# EAGLE design MicroSD Module (EAGLE 6.1)
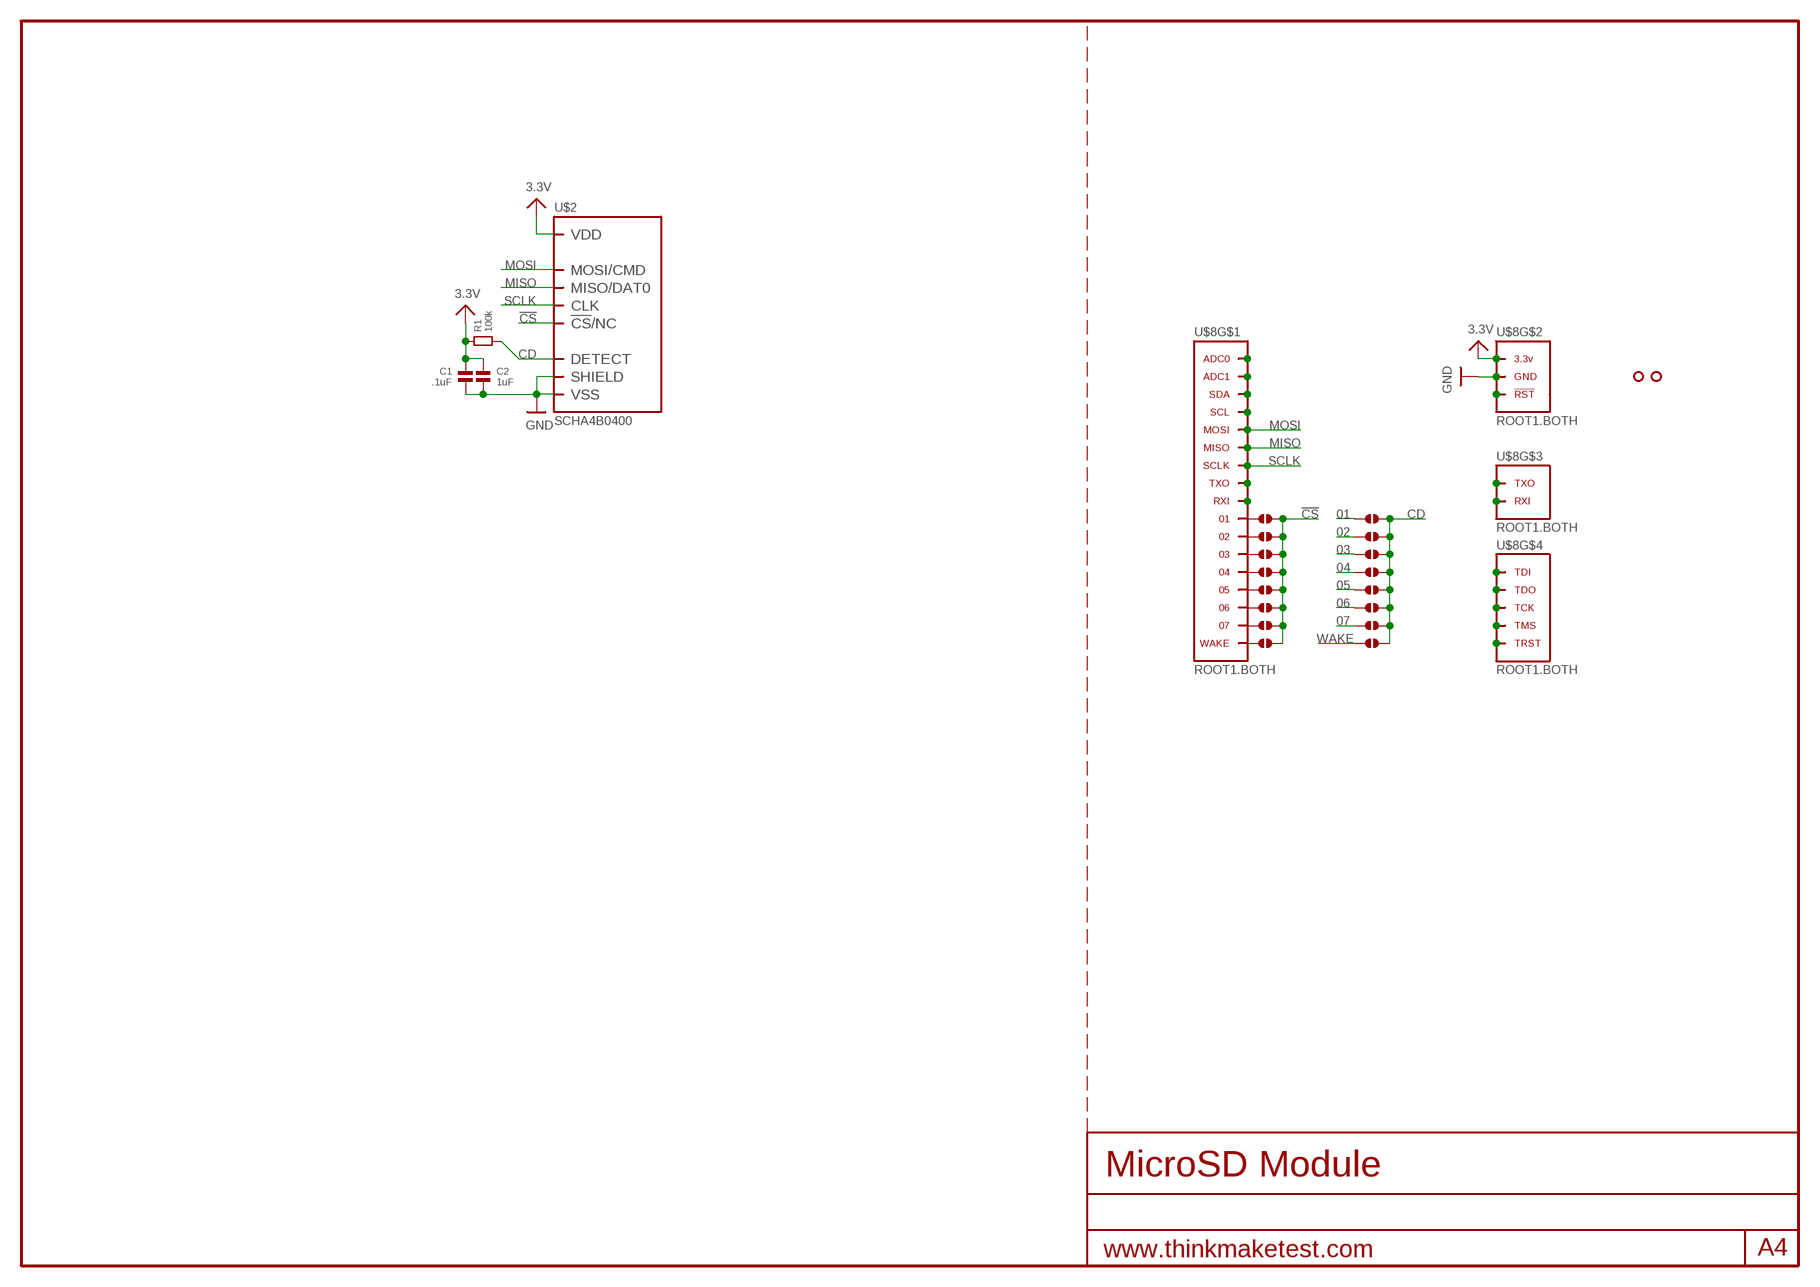
[diagram p0: schematic, sheet 1]

## Parts
C1  .1uF  CAPACITOR.0603  [0603]
C2  1uF  CAPACITOR.0603  [0603]
J1  SOLDERJUMPER.2.SML  [2.SML]
J2  SOLDERJUMPER.2.SML  [2.SML]
J3  SOLDERJUMPER.2.SML  [2.SML]
J4  SOLDERJUMPER.2.SML  [2.SML]
J5  SOLDERJUMPER.2.SML  [2.SML]
J6  SOLDERJUMPER.2.SML  [2.SML]
J7  SOLDERJUMPER.2.SML  [2.SML]
J8  SOLDERJUMPER.2.SML  [2.SML]
J9  SOLDERJUMPER.2.SML  [2.SML]
J10  SOLDERJUMPER.2.SML  [2.SML]
J11  SOLDERJUMPER.2.SML  [2.SML]
J12  SOLDERJUMPER.2.SML  [2.SML]
J13  SOLDERJUMPER.2.SML  [2.SML]
J14  SOLDERJUMPER.2.SML  [2.SML]
J15  SOLDERJUMPER.2.SML  [2.SML]
J16  SOLDERJUMPER.2.SML  [2.SML]
R1  100k  RESISTOR.0603  [0603]
U$2  SCHA4B0400  [SCHA4B0400]
U$3  HOLE.2MM  [2MM]
U$4  HOLE.2MM  [2MM]
U$8  ROOT1.BOTH  [ROOT1.BOTH]

## Nets
01: J1.1 J9.1 U$8.01 U$8.01@1 U$8.01@VIA
02: J2.1 J10.1 U$8.02 U$8.02@1 U$8.02@VIA
03: J3.1 J11.1 U$8.03 U$8.03@1 U$8.03@VIA
3.3V: C1.1 C2.1 R1.1 U$2.VDD U$8.3.3V@1(3.3V) U$8.3.3V@2(3.3V) U$8.3.3V@3(3.3V) U$8.3.3V@4(3.3V) U$8.3.3V@5(3.3V) U$8.3.3V@6(3.3V) U$8.3.3V@7(3.3V) U$8.3.3V@8(3.3V) U$8.3.3V@9(3.3V) U$8.3.3V@10(3.3V) U$8.3.3V@11(3.3V) U$8.3.3V@12(3.3V) U$8.3.3V@13(3.3V) U$8.3.3V@14(3.3V) U$8.3.3V@15(3.3V) U$8.3.3V@16(3.3V) U$8.3.3V@17(3.3V) U$8.3.3V@18(3.3V) U$8.3.3V@19(3.3V) U$8.3.3V@20(3.3V) U$8.3.3V@21(3.3V) U$8.3.3V@22(3.3V) U$8.3.3V@23(3.3V) U$8.3.3V@24(3.3V) U$8.3.3V@VIA(3.3V)
04: J4.1 J12.1 U$8.04 U$8.04@1 U$8.04@VIA
05: J5.1 J13.1 U$8.05 U$8.05@1 U$8.05@VIA
06: J6.1 J14.1 U$8.06 U$8.06@1 U$8.06@VIA
07: J7.1 J15.1 U$8.07 U$8.07@1 U$8.07@VIA
!CS!: J1.2 J2.2 J3.2 J4.2 J5.2 J6.2 J7.2 J8.2 U$2.!CS!/NC/DAT3(!CS!/NC)
CD: J9.2 J10.2 J11.2 J12.2 J13.2 J14.2 J15.2 J16.2 R1.2 U$2.CD(DETECT)
GND: C1.2 C2.2 U$2.GND(VSS) U$2.GND@1(VSS) U$2.GND@2(VSS) U$2.SHIELD U$2.SHIELD@1(SHIELD) U$2.SHIELD@2(SHIELD) U$2.SHIELD@3(SHIELD) U$2.VSS U$8.GND@1(GND) U$8.GND@2(GND) U$8.GND@3(GND) U$8.GND@4(GND) U$8.GND@5(GND) U$8.GND@6(GND) U$8.GND@7(GND) U$8.GND@8(GND) U$8.GND@9(GND) U$8.GND@10(GND) U$8.GND@11(GND) U$8.GND@12(GND) U$8.GND@13(GND) U$8.GND@14(GND) U$8.GND@15(GND) U$8.GND@16(GND) U$8.GND@17(GND) U$8.GND@18(GND) U$8.GND@19(GND) U$8.GND@20(GND) U$8.GND@21(GND) U$8.GND@22(GND) U$8.GND@23(GND) U$8.GND@24(GND) U$8.GND@25(GND) U$8.GND@26(GND) U$8.GND@VIA(GND)
MISO: U$2.MISO/DAT0 U$8.MISO U$8.MISO@1(MISO) U$8.MISO@VIA(MISO)
MOSI: U$2.MOSI/CMD U$8.MOSI U$8.MOSI@1(MOSI) U$8.MOSI@VIA(MOSI)
N$1: U$8.ADC0 U$8.ADC0@1(ADC0) U$8.ADC0@VIA(ADC0)
N$2: U$8.ADC1 U$8.ADC1@1(ADC1) U$8.ADC1@VIA(ADC1)
N$3: U$8.SDA U$8.SDA@1(SDA) U$8.SDA@VIA(SDA)
N$4: U$8.SCL U$8.SCL@1(SCL) U$8.SCL@VIA(SCL)
N$5: U$8.RXI U$8.RXI@1(RXI) U$8.RXI@VIA(RXI)
N$6: U$8.TXO.DBG(TXO) U$8.TXO.DBG@1(TXO) U$8.TXO.DBG@VIA(TXO)
N$7: U$8.RXI.DBG(RXI) U$8.RXI.DBG@1(RXI) U$8.RXI.DBG@VIA(RXI)
N$8: U$8.TXO U$8.TXO@1(TXO) U$8.TXO@VIA(TXO)
N$9: U$8.TDI U$8.TDI@1(TDI) U$8.TDI@VIA(TDI)
N$10: U$8.TDO U$8.TDO@1(TDO) U$8.TDO@VIA(TDO)
N$11: U$8.TCK U$8.TCK@1(TCK) U$8.TCK@VIA(TCK)
N$12: U$8.TMS U$8.TMS@1(TMS) U$8.TMS@VIA(TMS)
N$13: U$8.TRST U$8.TRST@1(TRST) U$8.TRST@VIA(TRST)
N$14: U$8.RST(!RST) U$8.RST@1(!RST) U$8.RST@VIA(!RST)
SCLK: U$2.CLK U$8.SCLK U$8.SCLK@1(SCLK) U$8.SCLK@VIA(SCLK)
WAKE: J8.1 J16.1 U$8.WAKE U$8.WAKE@1(WAKE) U$8.WAKE@VIA(WAKE)

## Library data of the parts
C1 C2 = .standardparts:CAPACITOR
J1-J16 = .solderjumper:SOLDERJUMPER.2
R1 = .standardparts:RESISTOR
U$2 = alps:SCHA4B0400
U$3 U$4 = .screw_holes:HOLE
U$8 = thinkmaketest:ROOT1

## Board
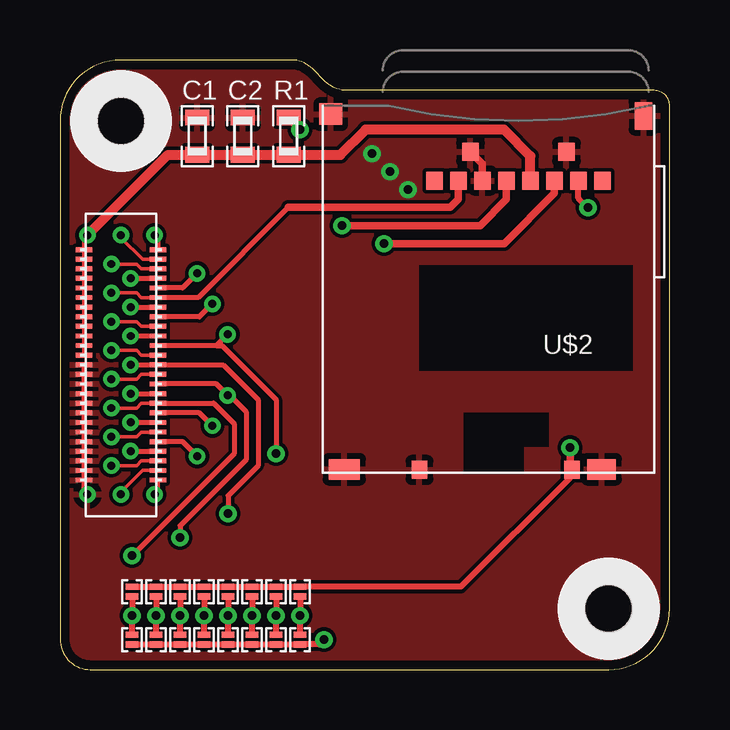
[diagram p1: board, top side]
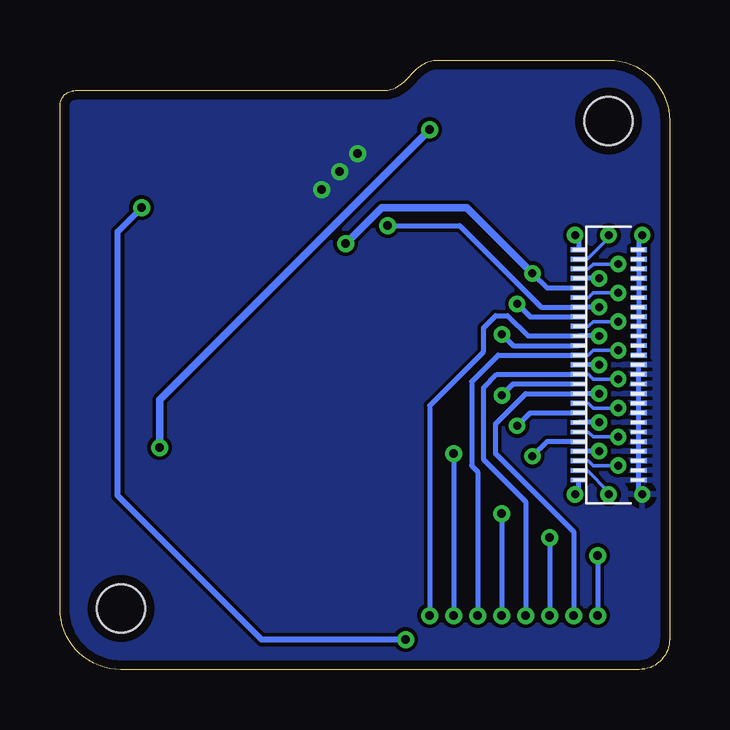
[diagram p2: board, bottom side, seen from below]

Size 25.4 x 25.4 mm. Coordinates in mm from the lower left corner, seen from the top.
Outline: 0,22.86 0,1.27 arc90 1.27,0 22.86,0 arc90 25.4,2.54 25.4,23.5 arc90 24.77,24.13 11.96,24.13 arc-45 11.06,24.5 10.53,25.03 arc45 9.63,25.4 2.54,25.4 arc90 0,22.86
Copper layers (1*16): Top 0.0356mm / dielectric 1.5011mm / Bottom 0.0356mm
Design rules "default": minimum track width 6mil, minimum drill 13mil, track to track 6mil, track to pad 6mil, pad to pad 6mil, via to via 6mil, smd to smd 6mil, copper to edge 15mil, drill to drill 6mil, minimum pad ring 7mil, minimum via ring 7mil, stop-mask expansion 4mil, vias tented up to drill 16mil, thermal gap 10mil

### Footprints (pad centres in the part's own frame; a part is rotated, then mirrored left to right if it is on the bottom)
0603 = smd 0.65 x 1: 1 -0.775,0; 2 0.775,0
2.SML = smd 0.254 x 0.508: 1 -0.203,0; 2 0.203,0
SCHA4B0400 = smd 0.7 x 0.75: !CS!/NC/DAT3 3.163,3.125; CLK 6.162,3.125; GND 3.663,1.925; GND@1 7.662,1.925; MISO/DAT0 8.162,3.125; MOSI/CMD 4.162,3.125; NC/NC/DAT1 9.162,3.125; NC/NC/DAT2 2.163,3.125; VDD 5.162,3.125; VSS 7.162,3.125 | smd 0.65 x 0.75: CD 3.438,15.175; GND@2 9.787,15.175 | smd 0.745 x 1.15: SHIELD 0.453,0.425 | smd 0.95 x 0.9: SHIELD@1 13.488,0.35 | smd 1.3 x 0.85: SHIELD@2 12.925,15.15 | smd 1.2 x 0.85: SHIELD@3 2.2,15.15
2MM = hole 2: 0,0
ROOT1.BOTH = smd 0.66 x 0.2 bottom: 01 3.795,13.9; 02 3.795,13.5; 03 3.795,13.1; 3.3V@1 1.285,17.5; 3.3V@2 1.285,17.1; 3.3V@3 1.285,16.7; 3.3V@4 1.285,16.3; 3.3V@5 1.285,15.9; 3.3V@6 1.285,15.5; 3.3V@7 1.285,15.1; 3.3V@8 1.285,14.7; 3.3V@9 1.285,14.3; 3.3V@10 1.285,13.9; 3.3V@11 1.285,13.5; 3.3V@12 1.285,13.1; 04 3.795,12.7; 05 3.795,12.3; 06 3.795,11.9; 07 3.795,11.5; ADC0 3.795,17.5; ADC1 3.795,17.1; GND@1 1.285,7.9; GND@2 1.285,8.3; GND@3 1.285,8.7; GND@4 1.285,9.1; GND@5 1.285,9.5; GND@6 1.285,9.9; GND@7 1.285,10.3; GND@8 1.285,10.7; GND@9 1.285,11.1; GND@10 1.285,11.5; GND@11 1.285,11.9; GND@12 1.285,12.3; GND@13 1.285,12.7; MISO 3.795,15.5; MOSI 3.795,15.9; RST 3.795,7.9; RXI 3.795,14.3; RXI.DBG 3.795,10.3; SCL 3.795,16.3; SCLK 3.795,15.1; SDA 3.795,16.7; TCK 3.795,9.1; TDI 3.795,9.9; TDO 3.795,9.5; TMS 3.795,8.7; TRST 3.795,8.3; TXO 3.795,14.7; TXO.DBG 3.795,10.7; WAKE 3.795,11.1 | smd 0.7 x 0.2: 01@1 4.08,13.9; 02@1 4.08,13.5; 3.3V@13 1,17.5; 3.3V@14 1,17.1; 3.3V@15 1,16.7; 3.3V@16 1,16.3; 3.3V@17 1,15.9; 3.3V@18 1,15.5; 3.3V@19 1,15.1; 3.3V@20 1,14.7; 3.3V@21 1,14.3; 3.3V@22 1,13.9; 3.3V@23 1,13.5; 3.3V@24 1,13.1; 03@1 4.08,13.1; 04@1 4.08,12.7; 05@1 4.08,12.3; 06@1 4.08,11.9; 07@1 4.08,11.5; ADC0@1 4.08,17.5; ADC1@1 4.08,17.1; GND@14 1,7.9; GND@15 1,8.3; GND@16 1,8.7; GND@17 1,9.1; GND@18 1,9.5; GND@19 1,9.9; GND@20 1,10.3; GND@21 1,10.7; GND@22 1,11.1; GND@23 1,11.5; GND@24 1,11.9; GND@25 1,12.3; GND@26 1,12.7; MISO@1 4.08,15.5; MOSI@1 4.08,15.9; RST@1 4.08,7.9; RXI.DBG@1 4.08,10.3; RXI@1 4.08,14.3; SCL@1 4.08,16.3; SCLK@1 4.08,15.1; SDA@1 4.08,16.7; TCK@1 4.08,9.1; TDI@1 4.08,9.9; TDO@1 4.08,9.5; TMS@1 4.08,8.7; TRST@1 4.08,8.3; TXO.DBG@1 4.08,10.7; TXO@1 4.08,14.7; WAKE@1 4.08,11.1 | drill 0.33 pad 0.686: 01@VIA 2.94,13.9; 02@VIA 6.985,13.97; 3.3V@VIA 1.14,18.1; 03@VIA 2.14,13.3; 04@VIA 2.94,12.7; 05@VIA 2.14,12.1; 06@VIA 6.985,11.43; 07@VIA 2.94,11.5; ADC0@VIA 3.94,18.1; ADC1@VIA 2.54,18.1; GND@VIA 1.14,7.3; MISO@VIA 2.14,15.7; MOSI@VIA 5.715,16.51; RST@VIA 3.94,7.3; RXI.DBG@VIA 2.94,10.3; RXI@VIA 2.14,14.5; SCL@VIA 2.94,16.3; SCLK@VIA 2.94,15.1; SDA@VIA 2.14,16.9; TCK@VIA 2.94,9.1; TDI@VIA 2.14,9.7; TDO@VIA 5.715,8.89; TMS@VIA 2.14,8.5; TRST@VIA 2.54,7.3; TXO.DBG@VIA 6.35,10.16; TXO@VIA 6.35,15.24; WAKE@VIA 2.14,10.9

### Placement (x,y rotation side)
C1  5.71,22.23 90 top
C2  7.62,22.23 90 top
J1  10,1.25 270 top
J2  9,1.25 270 top
J3  8,1.25 270 top
J4  7,1.25 270 top
J5  6,1.25 270 top
J6  5,1.25 270 top
J7  4,1.25 270 top
J8  3,1.25 270 top
J9  10,3.25 90 top
J10  9,3.25 90 top
J11  8,3.25 90 top
J12  7,3.25 90 top
J13  6,3.25 90 top
J14  5,3.25 90 top
J15  4,3.25 90 top
J16  3,3.25 90 top
R1  9.53,22.23 90 top
U$2  24.77,23.5 180 top
U$3  22.86,2.54 90 top
U$4  2.54,22.86 90 top
U$8  0,0 0 top

### Tracks (layer width: path | path; a pad name or v marks a point on that pad's centre or on a via)
01  (via drill 0.36)
  Top 0.254: J1.1 v10,2.25 J9.1
  Bottom 0.203: U$8.01 5.9,13.9 6.75,14.75 7.25,14.75 7.75,14.25 7.75,13.25 10,11 v10,2.25
02  (via drill 0.36)
  Top 0.203: 6.51,13.5 6.75,13.5 9,11.25 v9,9
  Top 0.254: J2.1 v9,2.25 J10.1
  Bottom 0.203: v9,9 v9,2.25
03  (via drill 0.36)
  Top 0.254: J3.1 v8,2.25 J11.1
  Bottom 0.203: U$8.03 7.15,13.1 8.25,12 8.25,8.5 8,8.25 v8,2.25
3.3V
  Top 0.406: U$2.VDD 19.6,21.4 18.5,22.5 12.73,22.5 11.68,21.45 R1.1 C2.1 C1.1 4.49,21.45 U$8.3.3V@VIA
04  (via drill 0.36)
  Top 0.203: U$8.04@1 6.8,12.7 8.25,11.25 8.25,8.5 7,7.25 v7,6.5
  Top 0.254: J4.1 v7,2.25 J12.1
  Bottom 0.203: v7,6.5 v7,2.25
05  (via drill 0.36)
  Top 0.254: J5.1 v6,2.25 J13.1
  Bottom 0.203: U$8.05 7.2,12.3 7.75,11.75 7.75,8.75 6,7 v6,2.25
06  (via drill 0.36)
  Top 0.203: U$8.06@VIA 7.07,11.43 7.75,10.75 7.75,8.75 5,6 v5,5.5
  Top 0.254: J6.1 v5,2.25 J14.1
  Bottom 0.203: v5,5.5 v5,2.25
07  (via drill 0.36)
  Top 0.254: J7.1 v4,2.25 J15.1
  Bottom 0.203: U$8.07 6,11.5 7.25,10.25 7.25,9 4,5.75 v4,2.25
!CS!  (via drill 0.36)
  Top 0.254: J8.2 J7.2 J6.2 J5.2 J4.2 J3.2 J2.2 J1.2 10.8,1.05 v11,1.25 | v22,19.25 21.6,19.65 U$2.!CS!/NC/DAT3
  Bottom 0.254: v11,1.25 17,1.25 23,7.25 23,18.25 v22,19.25
CD  (via drill 0.36)
  Top 0.254: J16.2 J15.2 J14.2 J13.2 J12.2 J11.2 J10.2 J9.2 16.7,3.45 21.25,8 21.25,8.4
  Top 0.305: R1.2 9.53,22.98 v10,22.5 | v21.25,9.25 21.25,8.4 U$2.CD
  Bottom 0.305: v10,22.5 21.25,11.25 v21.25,9.25
GND  (via drill 0.36)
  Top 0.305: U$2.GND@1 17.6,21.07 U$2.VSS
  other vias: 14.5,20 13.75,20.75 13,21.5
  pour Bottom: 0,0 25.4,0 25.4,25.4 0,25.4
  pour Top: 0,0 25.4,0 25.4,25.4 0,25.4
MISO
  Top 0.203: 9.52,19.27 5.75,15.5 U$8.MISO@1
  Top 0.305: U$2.MISO/DAT0 16.6,19.6 16.27,19.27 9.52,19.27
MOSI  (via drill 0.36)
  Top 0.305: U$2.MOSI/CMD 20.6,19.85 18.5,17.75 v13.5,17.75
  Bottom 0.305: v13.5,17.75 12,19.25 8.46,19.25 U$8.MOSI@VIA
SCLK  (via drill 0.36)
  Top 0.305: U$2.CLK 18.6,19.6 17.5,18.5 v11.75,18.5
  Bottom 0.203: v11.75,18.5 8.75,18.5 5.35,15.1 U$8.SCLK
WAKE  (via drill 0.36)
  Top 0.203: U$8.WAKE@1 6.4,11.1 7.25,10.25 7.25,9 v3,4.75
  Top 0.254: J8.1 v3,2.25 J16.1
  Bottom 0.203: v3,4.75 v3,2.25

### Text on the board
tDocu: CD | !CS
bDocu: Cruz Monrreal II | v1 | InnovativeMaker.com